# EAGLE schematic digitboard (EAGLE 9.5.2)
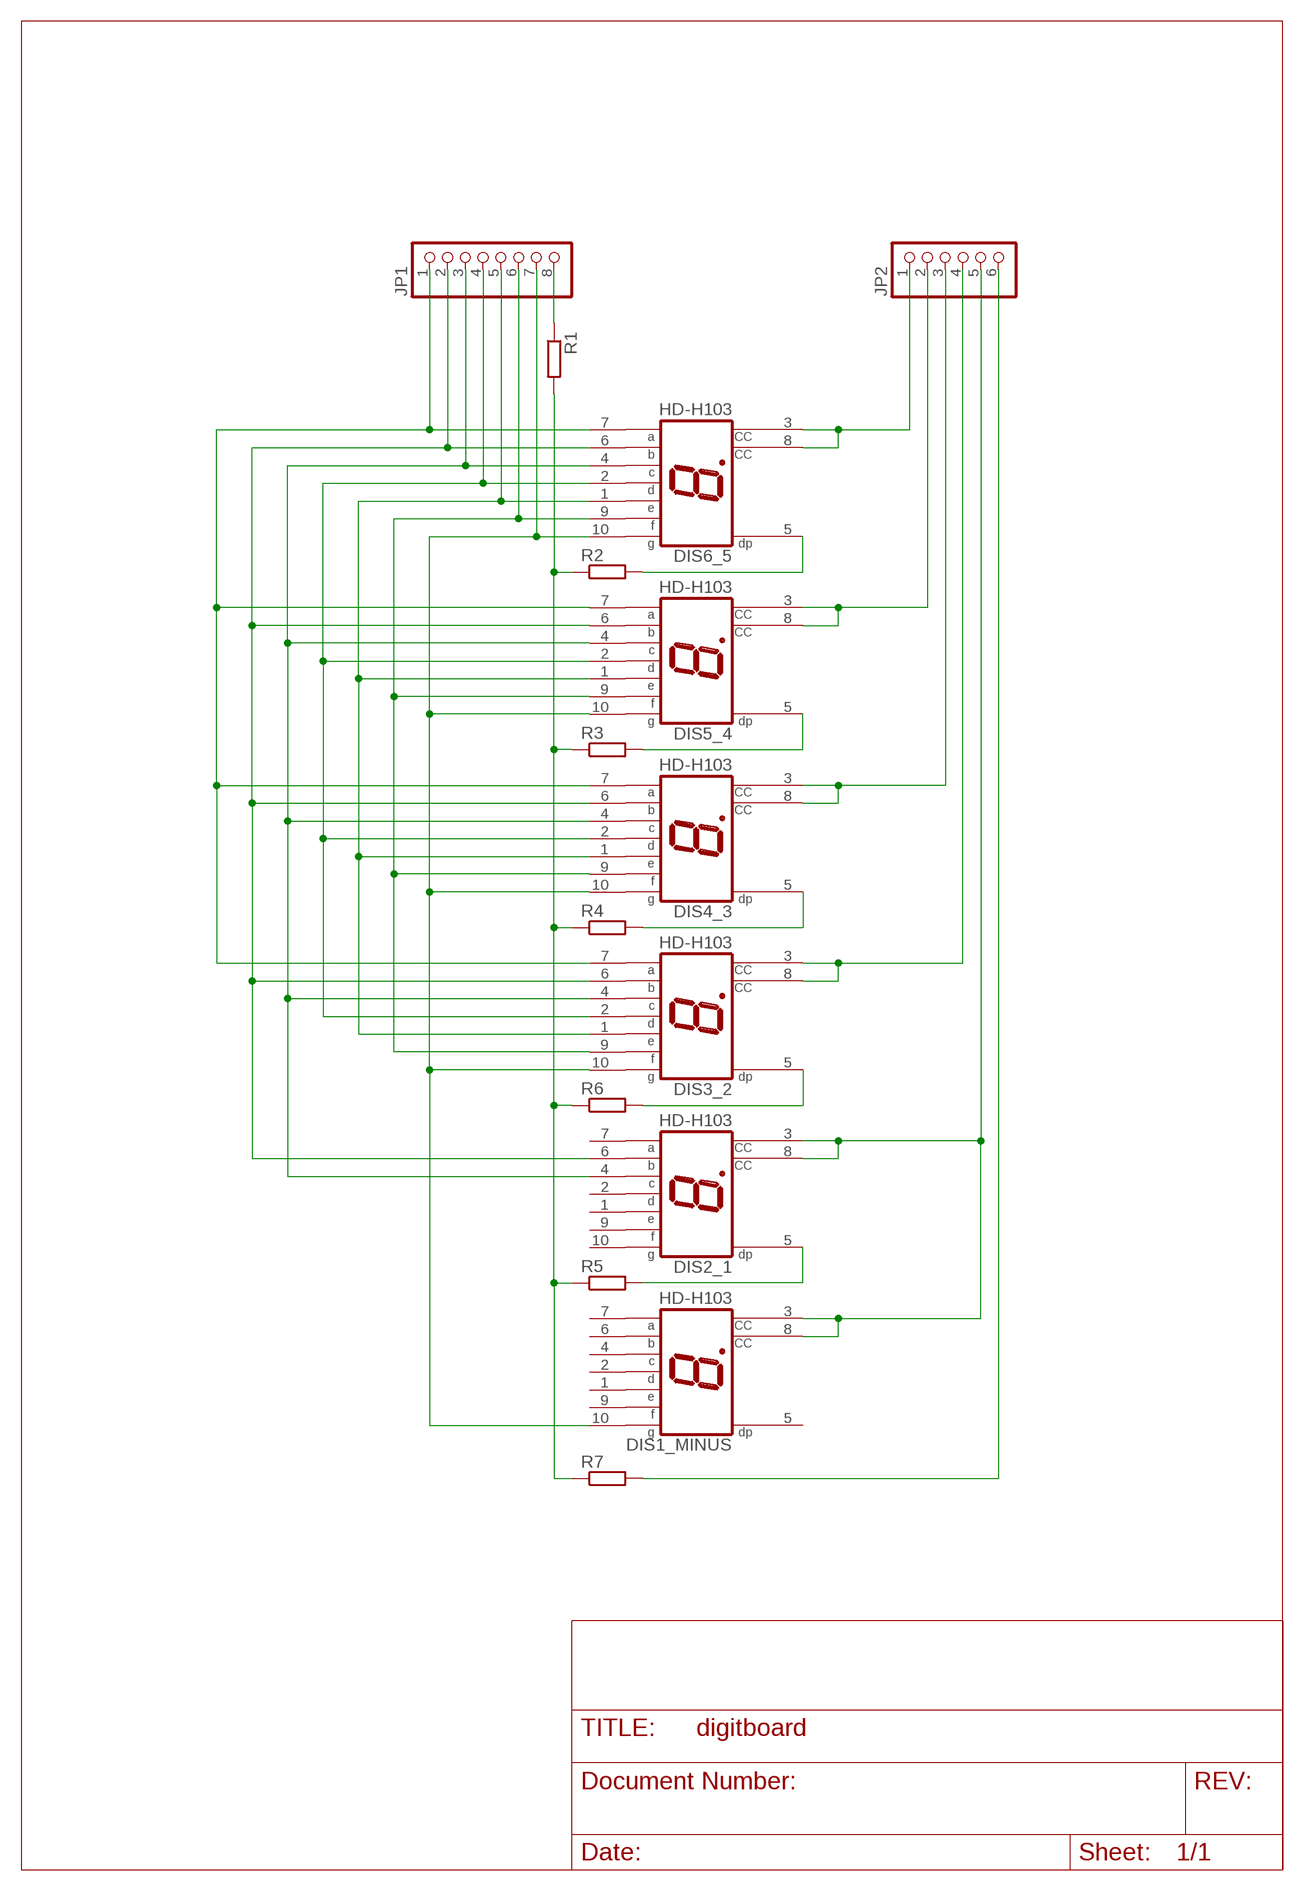
[diagram p0: schematic, sheet 1]

## Parts
DIS1_MINUS  HD-H103  [HDSP-M]
DIS2_1  HD-H103  [HDSP-M]
DIS3_2  HD-H103  [HDSP-M]
DIS4_3  HD-H103  [HDSP-M]
DIS5_4  HD-H103  [HDSP-M]
DIS6_5  HD-H103  [HDSP-M]
JP1  PINHD-1X8  [1X08]
JP2  PINHD-1X6  [1X06]
R1  R-EU_R0603  [R0603]
R2  R-EU_R0603  [R0603]
R3  R-EU_R0603  [R0603]
R4  R-EU_R0603  [R0603]
R5  R-EU_R0603  [R0603]
R6  R-EU_R0603  [R0603]
R7  R-EU_R0603  [R0603]

## Nets
N$1: JP2.6 R7.2
N$2: R1.2 R2.1 R3.1 R4.1 R5.1 R6.1 R7.1
N$3: JP1.8 R1.1
N$4: DIS6_5.5(DP) R2.2
N$5: DIS5_4.5(DP) R3.2
N$6: DIS4_3.5(DP) R4.2
N$7: DIS3_2.5(DP) R6.2
N$8: DIS2_1.5(DP) R5.2
N$42: DIS3_2.7(A) DIS4_3.7(A) DIS5_4.7(A) DIS6_5.7(A) JP1.1
N$43: DIS2_1.6(B) DIS3_2.6(B) DIS4_3.6(B) DIS5_4.6(B) DIS6_5.6(B) JP1.2
N$44: DIS2_1.4(C) DIS3_2.4(C) DIS4_3.4(C) DIS5_4.4(C) DIS6_5.4(C) JP1.3
N$45: DIS3_2.2(D) DIS4_3.2(D) DIS5_4.2(D) DIS6_5.2(D) JP1.4
N$46: DIS3_2.1(E) DIS4_3.1(E) DIS5_4.1(E) DIS6_5.1(E) JP1.5
N$47: DIS3_2.9(F) DIS4_3.9(F) DIS5_4.9(F) DIS6_5.9(F) JP1.6
N$48: DIS1_MINUS.10(G) DIS3_2.10(G) DIS4_3.10(G) DIS5_4.10(G) DIS6_5.10(G) JP1.7
N$50: DIS6_5.3(CC) DIS6_5.8(CC) JP2.1
N$51: DIS5_4.3(CC) DIS5_4.8(CC) JP2.2
N$52: DIS4_3.3(CC) DIS4_3.8(CC) JP2.3
N$53: DIS3_2.3(CC) DIS3_2.8(CC) JP2.4
N$54: DIS1_MINUS.3(CC) DIS1_MINUS.8(CC) DIS2_1.3(CC) DIS2_1.8(CC) JP2.5
Unconnected: DIS1_MINUS.1(E) DIS1_MINUS.2(D) DIS1_MINUS.4(C) DIS1_MINUS.5(DP) DIS1_MINUS.6(B) DIS1_MINUS.7(A) DIS1_MINUS.9(F) DIS2_1.1(E) DIS2_1.2(D) DIS2_1.7(A) DIS2_1.9(F) DIS2_1.10(G)

## Library data of the parts
DIS1_MINUS DIS2_1 DIS3_2 DIS4_3 DIS5_4 DIS6_5 = display-hp:HD-H103: LED DISPLAY 1-character 7 segment, decimal point right; OC_FARNELL: unknown; OC_NEWARK: unknown
JP1 = pinhead:PINHD-1X8: PIN HEADER
JP2 = pinhead:PINHD-1X6: PIN HEADER
R1-R7 = rcl:R-EU_: RESISTOR, European symbol